# EAGLE design Battery-Board (EAGLE 9.6.2)
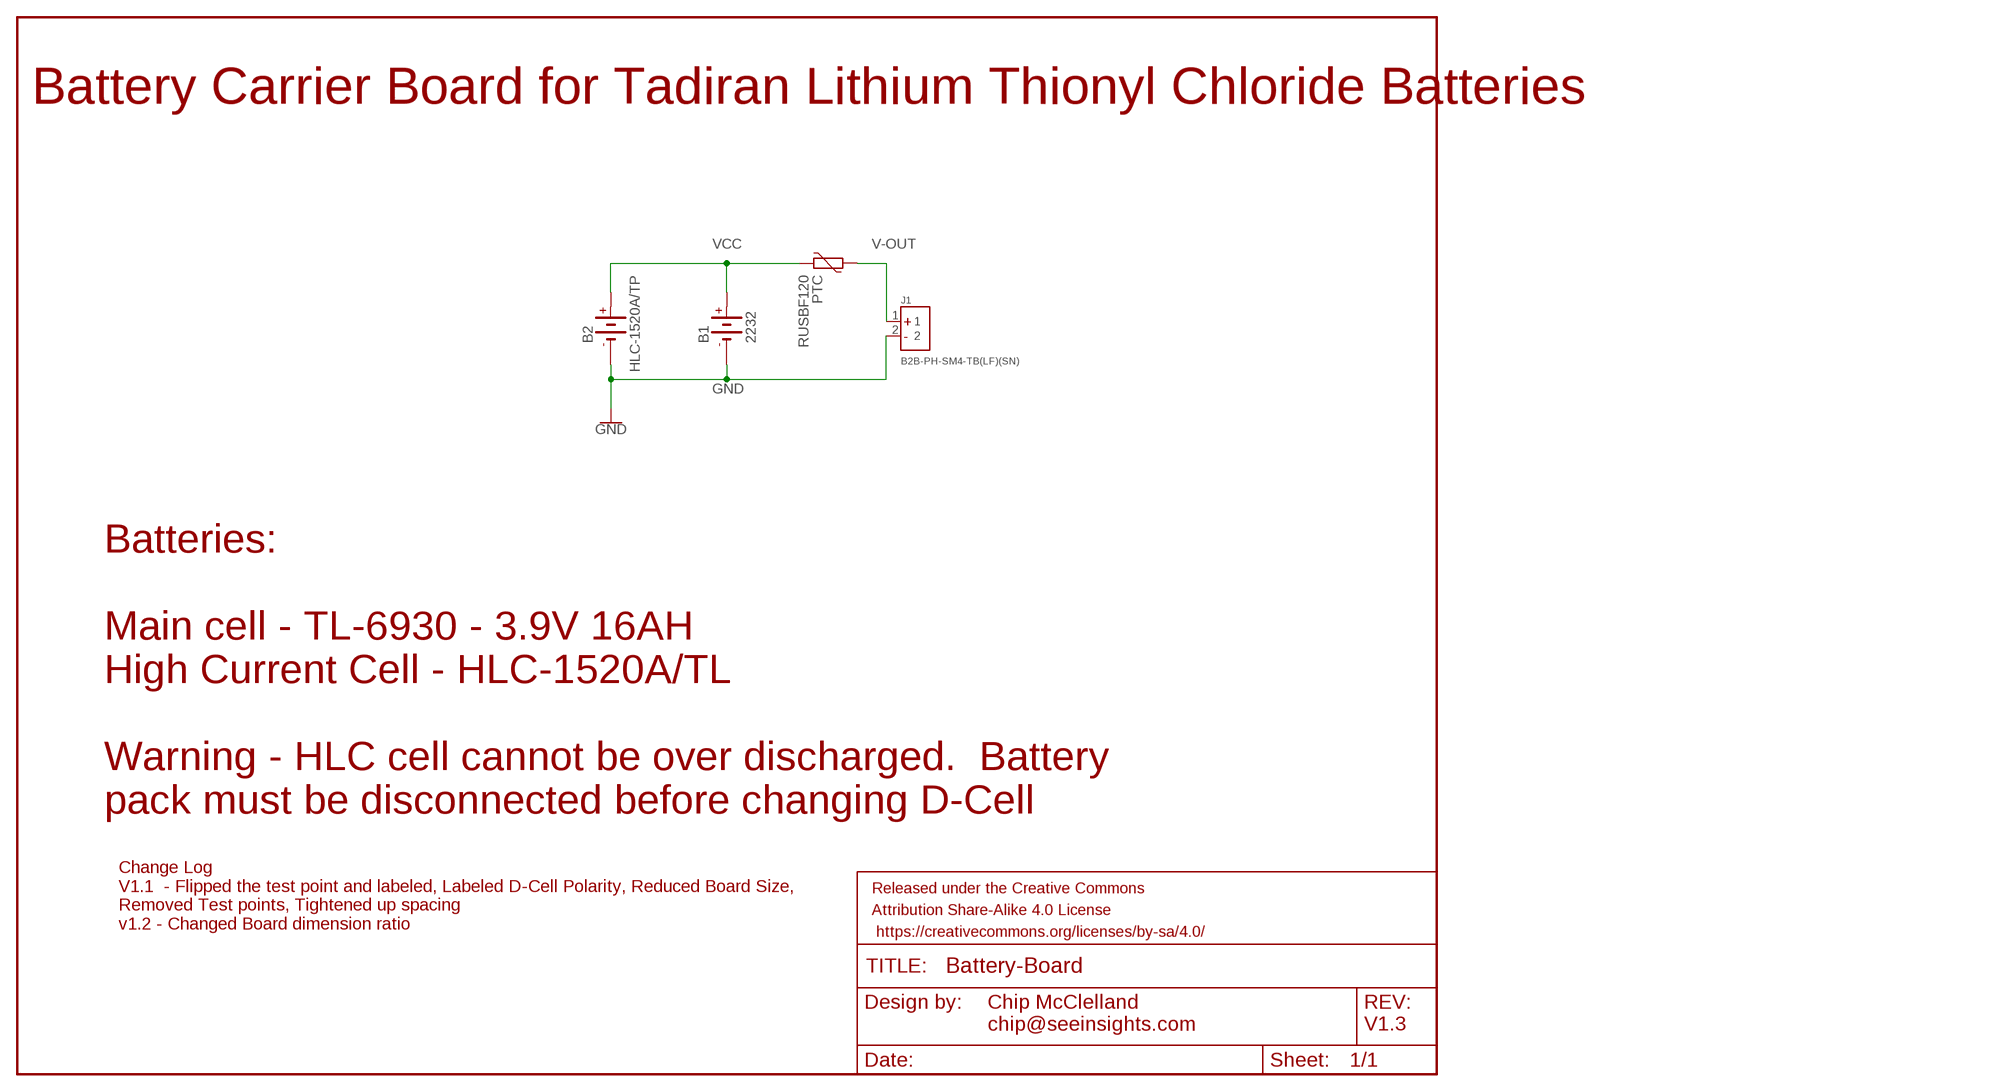
[diagram p0: schematic, sheet 1]

## Parts
B1  2232  [2232]
B2  HLC-1520A/TP  [HLC-1520A/TP]
FRAME1  FRAME-LETTER  [CREATIVE_COMMONS]
J1  B2B-PH-SM4-TB(LF)(SN)  [JST_B2B-PH-SM4-TB(LF)(SN)]
PTC  RUSBF120  [PTC-RUSBF120]

## Nets
GND: B1.- B2.- B2.--(-) J1.2
V-OUT: J1.1 PTC.2
VCC: B1.+ B2.+ PTC.1

## Notes on the sheet
- Battery Carrier Board for Tadiran Lithium Thionyl Chloride Batteries
- Batteries: 
  
  Main cell - TL-6930 - 3.9V 16AH
  High Current Cell - HLC-1520A/TL
  
  Warning - HLC cell cannot be over discharged.  Battery
  pack must be disconnected before changing D-Cell
- Change Log
  V1.1  - Flipped the test point and labeled, Labeled D-Cell Polarity, Reduced Board Size,
  Removed Test points, Tightened up spacing
  v1.2 - Changed Board dimension ratio
- Chip McClelland
  chip@seeinsights.com
- V1.3

## Library data of the parts
B1 = Battery-Board:2232: D-CELL HOLDER KEYSTONE Check availability <https://pricing.snapeda.com/parts/2226/Adafruit%20Industries/view-part?ref=eda>; AVAILABILITY: In Stock; DESCRIPTION: D-Cell Battery Holder; MF: Keystone; MP: 2226; PACKAGE: Adafruit Industries; PRICE: None; PURCHASE-URL: https://pricing.snapeda.com/search/part/2226/?ref=eda
B2 = Battery-Board:HLC-1520A/TP; MFG: Tadiran; MPN: HLC-1520A/TP
FRAME1 = SparkFun-Aesthetics:FRAME-LETTER: Schematic Frame - Letter Standard 8.5x11 US Letter frame
J1 = Custom Components:B2B-PH-SM4-TB(LF)(SN): PH Series 2 Position 2 mm Pitch Surface Mount Top Entry Shrouded Header; DESCRIPTION: Connector Header Surface Mount 2 position 0.079 (2.00mm); DIGI-KEY_PART_NUMBER: 455-1734-1-ND; MF: JST Sales; MP: B2B-PH-SM4-TB(LF)(SN); PACKAGE: None; PURCHASE-URL: https://pricing.snapeda.com/search/part/B2B-PH-SM4-TB(LF)(SN)/?ref=eda
PTC = Battery-Board:RUSBF120; MPN: RUSBF120; WEB: https://www.littelfuse.com/~/media/electronics/product_specifications/resettable_ptcs/littelfuse_ptc_rusbf120_product_specification.pdf.pdf

## Board
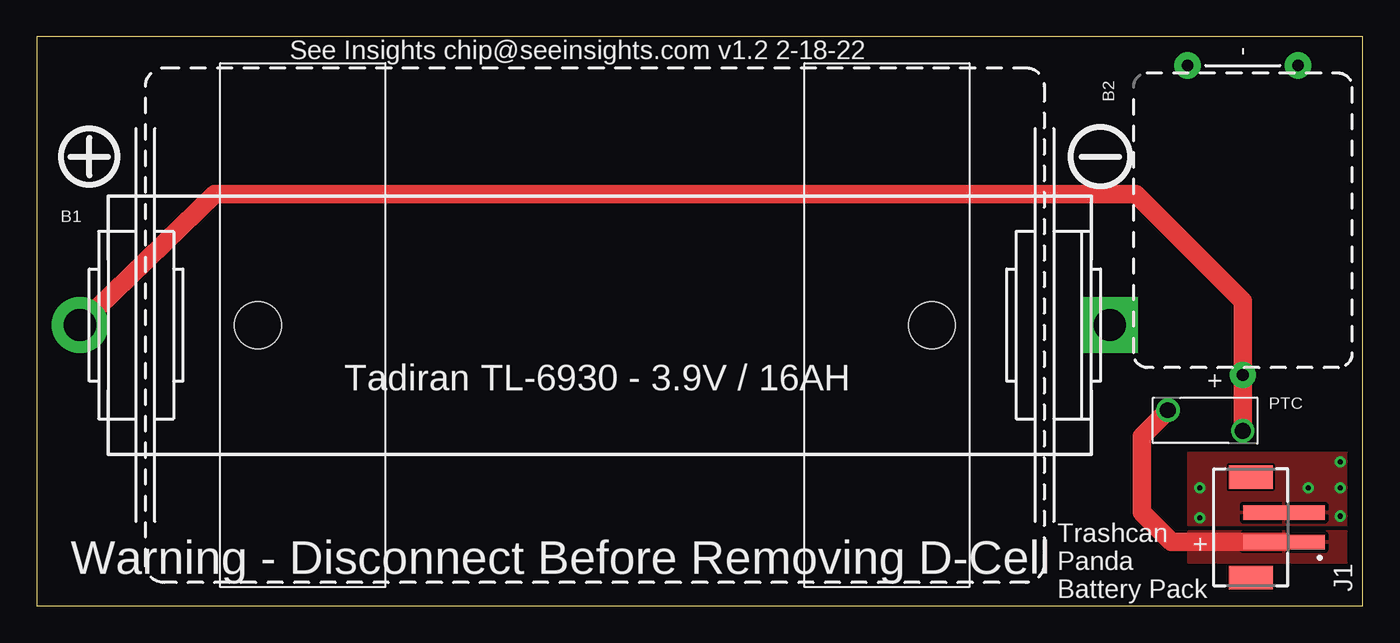
[diagram p1: board, top side]
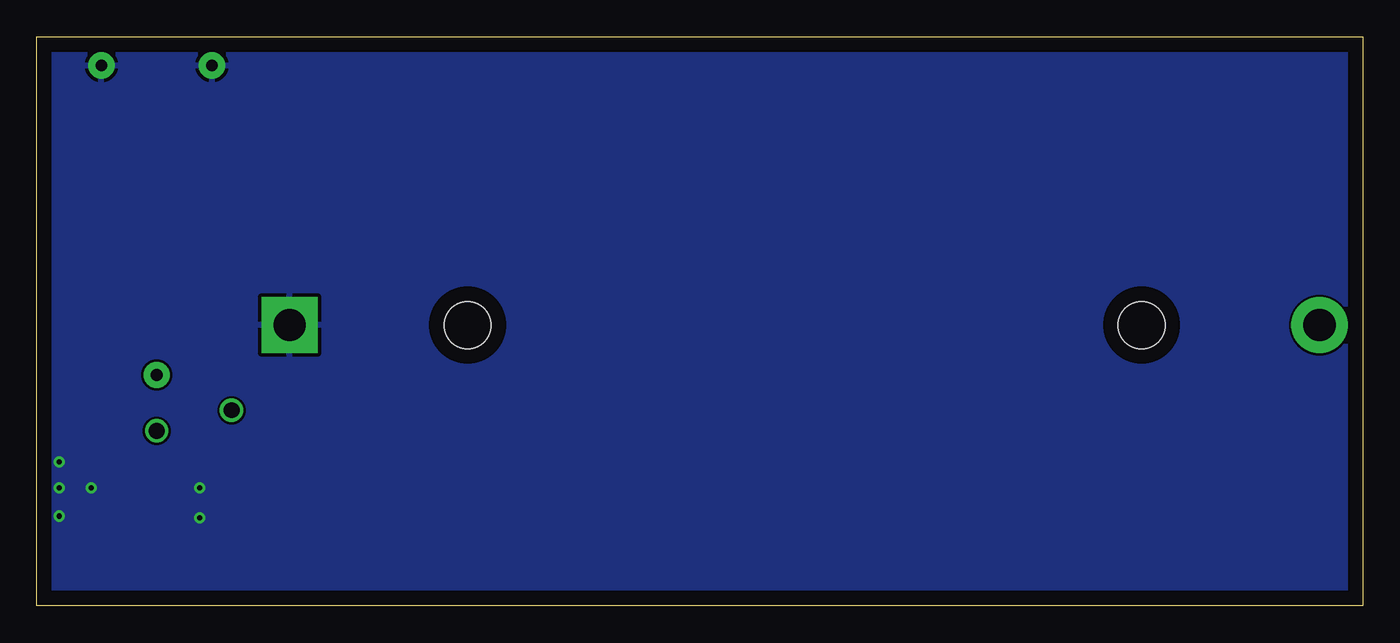
[diagram p2: board, bottom side, seen from below]

Size 89.92 x 38.61 mm. Coordinates in mm from the lower left corner, seen from the top.
Outline: 0,0 89.92,0 89.92,38.61 0,38.61 0,0
Copper layers (1*16): Top 0.035mm / dielectric 1.5mm / Bottom 0.035mm
Design rules "default": minimum track width 6mil, minimum drill 0.35mm, track to track 6mil, track to pad 6mil, pad to pad 6mil, via to via 6mil, smd to smd 6mil, copper to edge 40mil, drill to drill 6mil, minimum pad ring 10mil, minimum via ring 8mil, stop-mask expansion 4mil, vias tented up to drill 0mil, thermal gap 10mil

### Footprints (pad centres in the part's own frame; a part is rotated, then mirrored left to right if it is on the bottom)
2232 = drill 2.184 pad 3.81: + -34.925,0 | drill 2.184 pad 3.81 square: - 34.925,0 | hole 3.175: -22.86,0; 22.86,0
HLC-1520A/TP = drill 0.8 pad 1.778: + -10.5,0; - 10.5,3.75; -- 10.5,-3.75
JST_B2B-PH-SM4-TB(LF)(SN) = smd 1 x 5.5: 1 -1,0; 2 1,0 | smd 1.6 x 3: 3 -3.4,2.25; 4 3.4,2.25
PTC-RUSBF120 = drill 1.06: 1 -2.54,0.7; 2 2.54,-0.7

### Placement (x,y rotation side)
B1  37.85,19.05 0 top
B2  81.79,26.16 90 top
FRAME1  19.05,-16.51 0 top  (outside the outline)
J1  84.58,5.33 90 top
PTC  79.25,12.57 180 top

### Tracks (layer width: path | path; a pad name or v marks a point on that pad's centre or on a via)
GND  (via drill 0.35)
  other vias: 88.39,6.1 78.87,8 86.23,8 78.87,5.97 88.39,9.78 88.39,8
  pour Top: 78.11,10.41 89.53,10.41 89.53,5.46 78.11,5.46
  pour Bottom: -2.54,40.64 93.98,40.64 93.98,-2.54 -2.54,-2.54
V-OUT
  Top 1.27: PTC.2 74.93,11.49 74.93,6.35 76.95,4.33 J1.1
  pour Top: 78.11,5.08 89.53,5.08 89.53,2.92 78.11,2.92
VCC
  Top 1.27: B1.+ 12.06,27.94 74.55,27.94 81.79,20.7 B2.+ PTC.1

### Text on the board
tPlace: See Insights chip@seeinsights.com v1.2 2-18-22 | Tadiran TL-6930 - 3.9V / 16AH | + | Warning - Disconnect Before Removing D-Cell | Trashcan / Panda / Battery Pack